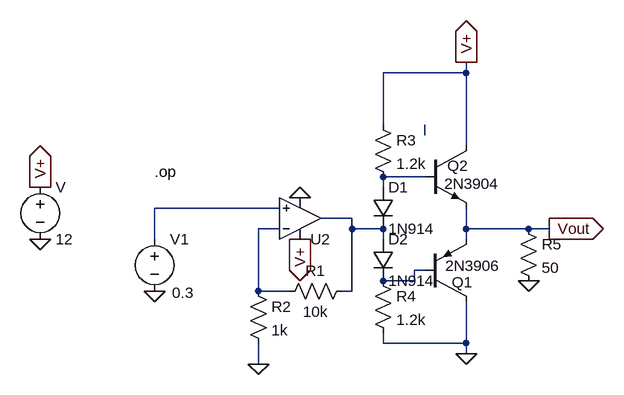
[diagram p0: schematic OpAmpCurrentBoosting.asc]
OpAmpCurrentBoosting.asc, the LTspice schematic file:
Version 4
SHEET 1 880 680
WIRE 576 -144 576 -160
WIRE 576 -144 448 -144
WIRE 448 -64 448 -144
WIRE 512 -48 512 -64
WIRE 576 -32 576 -144
WIRE 512 16 448 16
WIRE 448 32 448 16
WIRE 288 64 96 64
WIRE 400 80 352 80
WIRE 288 96 256 96
WIRE 400 96 400 80
WIRE 448 96 400 96
WIRE 576 96 576 64
WIRE 672 96 576 96
WIRE 704 96 672 96
WIRE 96 112 96 64
WIRE 448 112 448 96
WIRE 576 112 576 96
WIRE 512 160 496 160
WIRE 496 176 496 160
WIRE 496 176 448 176
WIRE 256 192 256 96
WIRE 304 192 256 192
WIRE 400 192 400 96
WIRE 400 192 384 192
WIRE 448 272 448 256
WIRE 576 272 576 208
WIRE 576 272 448 272
WIRE 576 288 576 272
WIRE 256 304 256 272
FLAG -80 112 0
FLAG -80 32 V+
IOPIN -80 32 Out
FLAG 320 112 V+
IOPIN 320 112 Out
FLAG 96 192 0
FLAG 576 -160 V+
IOPIN 576 -160 Out
FLAG 704 96 Vout
IOPIN 704 96 Out
FLAG 256 304 0
FLAG 320 48 0
FLAG 576 288 0
FLAG 672 176 0
DATAFLAG 592 96 ""
DATAFLAG 368 80 ""
DATAFLAG 496 -144 ""
SYMBOL OpAmps\\UniversalOpAmp 320 80 M180
SYMATTR InstName U2
SYMBOL voltage -80 16 R0
SYMATTR InstName V
SYMATTR Value 12
SYMBOL voltage 96 96 R0
WINDOW 3 27 98 Left 2
SYMATTR InstName V1
SYMATTR Value 0.3
SYMBOL res 400 176 R90
WINDOW 0 0 56 VBottom 2
WINDOW 3 32 56 VTop 2
SYMATTR InstName R1
SYMATTR Value 10k
SYMBOL pnp 512 208 M180
WINDOW 0 42 30 Left 2
WINDOW 3 32 55 Left 2
SYMATTR InstName Q1
SYMATTR Value 2N3906
SYMBOL npn 512 -32 R0
WINDOW 0 35 31 Left 2
WINDOW 3 30 59 Left 2
SYMATTR InstName Q2
SYMATTR Value 2N3904
SYMBOL res 432 -80 R0
SYMATTR InstName R3
SYMATTR Value 1.2k
SYMBOL diode 432 32 R0
SYMATTR InstName D1
SYMATTR Value 1N914
SYMBOL res 432 160 R0
SYMATTR InstName R4
SYMATTR Value 1.2k
SYMBOL diode 432 112 R0
SYMATTR InstName D2
SYMATTR Value 1N914
SYMBOL res 240 176 R0
SYMATTR InstName R2
SYMATTR Value 1k
SYMBOL res 656 80 R0
SYMATTR InstName R5
SYMATTR Value 50
TEXT 96 8 Left 2 !.op

The netlist it stands for:
* OpAmpCurrentBoosting.asc
XU2 N003 N005 V+ 0 N004 level1 Avol=1Meg GBW=10Meg Vos=0 En=0 Enk=0 In=0 Ink=0 Rin=500Meg  ; pins In+ In- V+ V- OUT
V V+ 0 12
V1 N003 0 0.3
R1 N004 N005 10k
Q1 0 N006 Vout 0 2N3906
Q2 V+ N002 Vout 0 2N3904
R3 V+ N002 1.2k
D1 N002 N004 1N914
R4 N006 0 1.2k
D2 N004 N006 1N914
R2 N005 0 1k
R5 Vout 0 50
.model D D
.lib standard.dio
.model NPN NPN
.model PNP PNP
.lib standard.bjt
.op
.lib UniversalOpAmp1.lib
.backanno
.end